# Altium schematic sheet MCU.SchDoc
size A3; ENG_APP_DATE: --/--/--; DSN_APP_DATE: --/--/--; CHK_APP_DATE: --/--/--; SheetNumber: 2; SheetTotal: 8
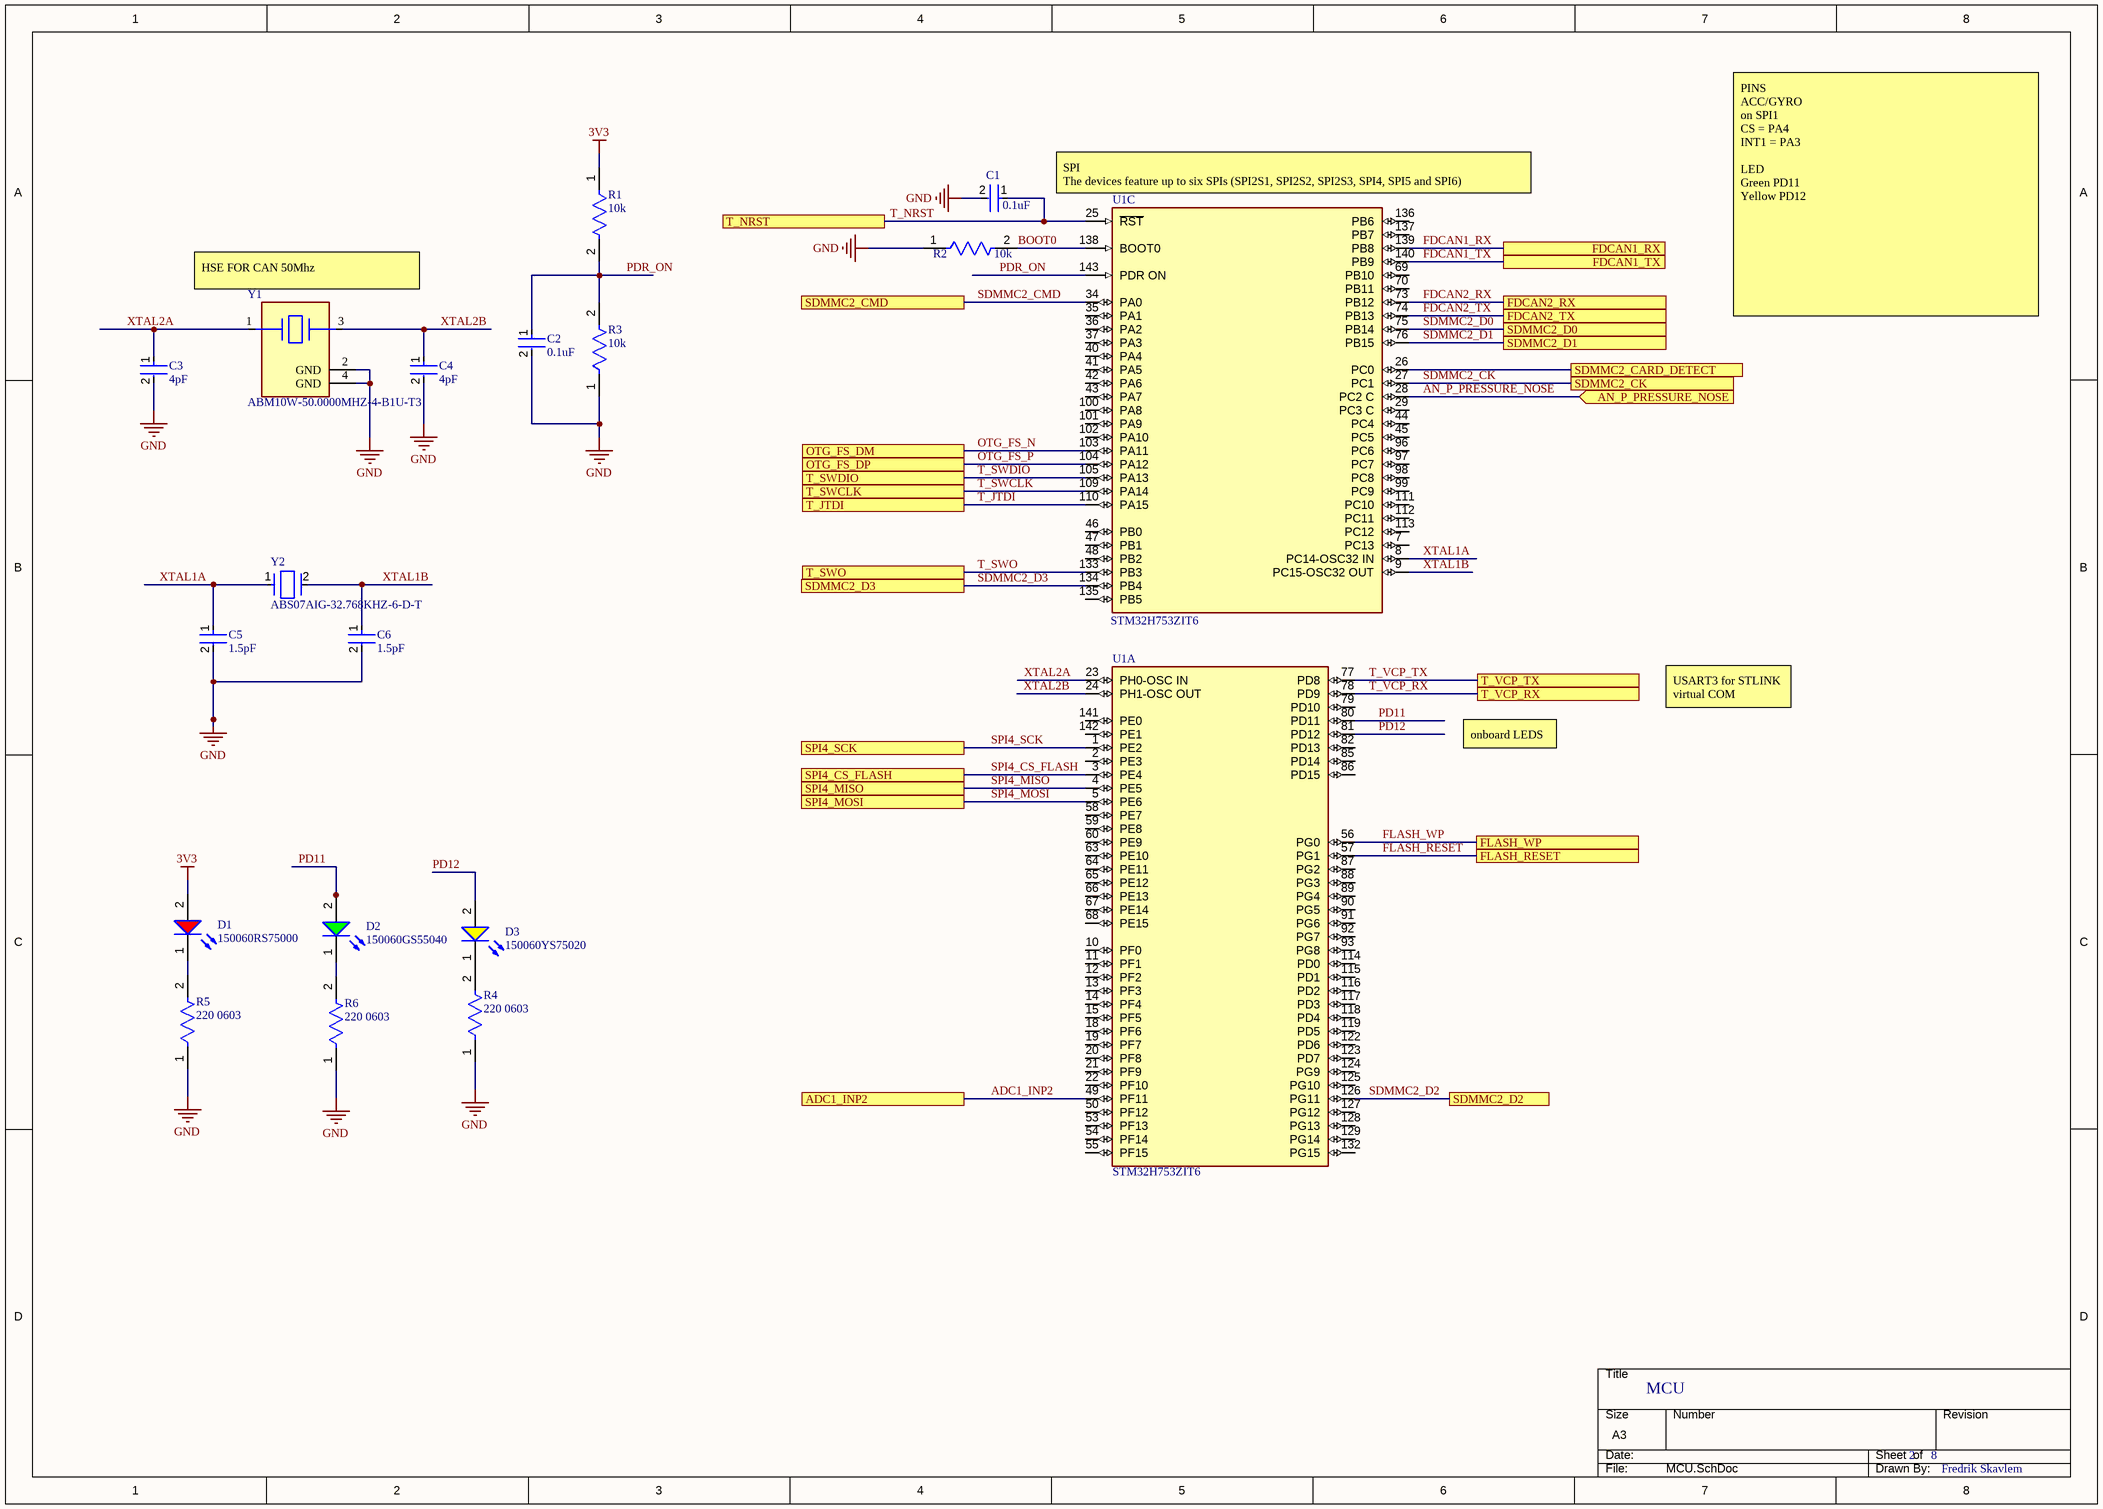
[diagram p0: MCU.SchDoc]

## Parts
C1  0.1uF  [FP-CL10-IPC_C]
C2  0.1uF  [FP-CL10-IPC_C]
C3  4pF  [FP-GQM187-0_15-IPC_B]
C4  4pF  [FP-GQM187-0_15-IPC_B]
C5  1.5pF  [FP-C0603C-CF-IPC_C]
C6  1.5pF  [FP-C0603C-CF-MFG]
D1  150060RS75000  [WL-SMCW_0603_150060xx75000]
D2  150060GS55040  [WL-SMCD_0603]
D3  150060YS75020  [WL-SMCW_0603_150060xx75020]
R1  10k  [FP-RT0603-IPC_C]
R2  10k  [FP-RT0603-IPC_C]
R3  10k  [FP-RT0603-IPC_C]
R4  220 0603  [FP-AF0603-IPC_C]
R5  220 0603  [FP-AF0603-IPC_C]
R6  220 0603  [FP-AF0603-IPC_C]
U1  STM32H753ZIT6  [FP-LQFP144-1A-MFG]  (parts A,C of 3)
Y1  ABM10W-50.0000MHZ-4-B1U-T3  [FP-ABM10W-MFG]
Y2  ABS07AIG-32.768KHZ-6-D-T  [FP-ABS07AIG-MFG]

## Ports
ADC1_INP2, AN_P_PRESSURE_NOSE (in), FDCAN1_RX, FDCAN1_TX, FDCAN2_RX, FDCAN2_TX, FLASH_RESET, FLASH_WP, OTG_FS_DM, OTG_FS_DP, SDMMC2_CARD_DETECT, SDMMC2_CK, SDMMC2_CMD, SDMMC2_D0, SDMMC2_D1, SDMMC2_D2, SDMMC2_D3, SPI4_CS_FLASH, SPI4_MISO, SPI4_MOSI, SPI4_SCK, T_JTDI, T_NRST, T_SWCLK, T_SWDIO, T_SWO, T_VCP_RX, T_VCP_TX

## Nets
3V3: D1.2(A) R1.1
GND: C1.2 C2.2 C3.2 C4.2 C5.2 C6.2 R2.1 R3.1 R4.1 R5.1 R6.1 Y1.2(GND) Y1.4(GND)
ADC1_INP2: U1.49(PF11) ; port ADC1_INP2
AN_P_PRESSURE_NOSE: U1.28(PC2_C) ; port AN_P_PRESSURE_NOSE
BOOT0: R2.2 U1.138(BOOT0)
FDCAN1_RX: U1.139(PB8) ; port FDCAN1_RX
FDCAN1_TX: U1.140(PB9) ; port FDCAN1_TX
FDCAN2_RX: U1.73(PB12) ; port FDCAN2_RX
FDCAN2_TX: U1.74(PB13) ; port FDCAN2_TX
FLASH_RESET: U1.57(PG1) ; port FLASH_RESET
FLASH_WP: U1.56(PG0) ; port FLASH_WP
OTG_FS_N: U1.103(PA11) ; port OTG_FS_DM
OTG_FS_P: U1.104(PA12) ; port OTG_FS_DP
PD11: D2.2(A) U1.80(PD11)
PD12: D3.2(A) U1.81(PD12)
PDR_ON: C2.1 R1.2 R3.2 U1.143(PDR_ON)
SDMMC2_CARD_DETECT: U1.26(PC0) ; port SDMMC2_CARD_DETECT
SDMMC2_CK: U1.27(PC1) ; port SDMMC2_CK
SDMMC2_CMD: U1.34(PA0) ; port SDMMC2_CMD
SDMMC2_D0: U1.75(PB14) ; port SDMMC2_D0
SDMMC2_D1: U1.76(PB15) ; port SDMMC2_D1
SDMMC2_D2: U1.126(PG11) ; port SDMMC2_D2
SDMMC2_D3: U1.134(PB4) ; port SDMMC2_D3
SPI4_CS_FLASH: U1.3(PE4) ; port SPI4_CS_FLASH
SPI4_MISO: U1.4(PE5) ; port SPI4_MISO
SPI4_MOSI: U1.5(PE6) ; port SPI4_MOSI
SPI4_SCK: U1.1(PE2) ; port SPI4_SCK
T_JTDI: U1.110(PA15) ; port T_JTDI
T_NRST: C1.1 U1.25(~{RST}) ; port T_NRST
T_SWCLK: U1.109(PA14) ; port T_SWCLK
T_SWDIO: U1.105(PA13) ; port T_SWDIO
T_SWO: U1.133(PB3) ; port T_SWO
T_VCP_RX: U1.78(PD9) ; port T_VCP_RX
T_VCP_TX: U1.77(PD8) ; port T_VCP_TX
XTAL1A: C5.1 U1.8(PC14-OSC32_IN) Y2.1
XTAL1B: C6.1 U1.9(PC15-OSC32_OUT) Y2.2
XTAL2A: C3.1 U1.23(PH0-OSC_IN) Y1.1
XTAL2B: C4.1 U1.24(PH1-OSC_OUT) Y1.3
NetD1_1: D1.1(K) R5.2
NetD2_1: D2.1(K) R6.2
NetD3_1: D3.1(K) R4.2

Not connected (* = marked no-connect by the designer): U1 2(PE3) 7(PC13) 10(PF0) 11(PF1) 12(PF2) 13(PF3) 14(PF4) 15(PF5) 18(PF6) 19(PF7) 20(PF8) 21(PF9) 22(PF10) 29(PC3_C) 35(PA1) 36(PA2) 37(PA3) 40(PA4) 41(PA5) 42(PA6) 43(PA7) 44(PC4) 45(PC5) 46(PB0) 47(PB1) 48(PB2) 50(PF12) 53(PF13) 54(PF14) 55(PF15) 58(PE7) 59(PE8) 60(PE9) 63(PE10) 64(PE11) 65(PE12) 66(PE13) 67(PE14) 68(PE15) 69(PB10) 70(PB11) 79(PD10) 82(PD13) 85(PD14) 86(PD15) 87(PG2) 88(PG3) 89(PG4) 90(PG5) 91(PG6) 92(PG7) 93(PG8) 96(PC6) 97(PC7) 98(PC8) 99(PC9) 100(PA8) 101(PA9) 102(PA10) 111(PC10) 112(PC11) 113(PC12) 114(PD0) 115(PD1) 116(PD2) 117(PD3) 118(PD4) 119(PD5) 122(PD6) 123(PD7) 124(PG9) 125(PG10) 127(PG12) 128(PG13) 129(PG14) 132(PG15) 135(PB5) 136(PB6) 137(PB7) 141(PE0) 142(PE1)

## Notes on the sheet
- (near U1) SPI
  The devices feature up to six SPIs (SPI2S1, SPI2S2, SPI2S3, SPI4, SPI5 and SPI6)
- (near Y1) HSE FOR CAN 50Mhz
- PINS
  ACC/GYRO
  on SPI1
  CS = PA4
  INT1 = PA3
  LED
  Green PD11
  Yellow PD12
- USART3 for STLINK virtual COM
- onboard LEDS
- MCU
- 2
- 8
- Fredrik Skavlem
- THIS DOCUMENT AND THE DATA DISCLOSED HEREIN OR
- HEREWITH IS THE PROPERTY OF ALTIUM LIMITED AND MAY
- DWG NO:
- REVISION
- REV:
- DESCRIPTION
- DATE
- APPROVED
- BE FREELY DISTRIBUTED IN WHOLE. NO RIGHTS ARE
- RESERVED OR EXPRESS OR IMPLIED WARANTEE GIVEN.
- ENG:
- APPROVALS
- PROJECT
- DSN:
- CHK:
- REFERENCE DOCUMENTS
- PROJECT REVISION:
- TITLE
- DOCUMENT REVISION:
- DESIGN ITEM:
- BOM:
- FAB DWG:
- PCB DWG:
- ASSY DWG:
- SCALE:
- A3
- SIZE
- CAGE CODE
- FILE NAME
- DWG NO.
- SHEET
- OF
- REV

## Library data of the parts
C1 C2 = CMP-13271-002683-1: Cap Ceramic 100nF 16V X7R ±10% Pad SMD 0603 +125°C T/R / CL10B104KO8WPNC; Voltage Rating: 16V; Max Operating Temperature: 125°C; Capacitance: 100nF; Features: Soft Termination; Length: 0.063inch; Packaging: Tape and Reel; Min Operating Temperature: -55°C; Mount: Surface Mount; Case/Package: 0603; Case Code (Metric): 1608; Width: 0.031inch; Ratings: AEC-Q200; Thickness: 0.035inch; Case Code (Imperial): 0603; Tolerance: 10%
C3 C4 = CMP-06035-061124-1: GQM1875C2E4R0BB12D / Ceramic Capacitor 4pF ±0.1pF 250VDC C0G 0603 Paper T/R; Voltage Rating: 250V; Thickness: 0.031inch; Packaging: Tape and Reel; Case Code (Metric): 1608; Series: GQM; Length: 1.6mm; Height: 0.7mm; Width: 0.8mm; Max Operating Temperature: 125°C; Case Code (Imperial): 0603; Capacitance: 4pF; Min Operating Temperature: -55°C; Construction: Flat; Package Quantity: 4000; Case/Package: 0603; Voltage Rating (DC): 250V; Mount: Surface Mount; Dielectric: C0G; Depth: 0.8mm; Termination: SMD/SMT; Radiation Hardening: No
C5 C6 = CMP-03020-023157-1: C0603 1.5 pF X8R 30ppm/°C 0.1 pF 25 V / C0603C159B3HACTU; Manufacturer: KEMET; Automotive Grade: Grade 1; Material: Ceramic; Tolerance: 0.1 pF; Voltage Rating: 25 V; Capacitance: 1.5 pF; Device Class L3: Ceramic Capacitors; Temperature Range High: +125°C; Category: Cap; Octopart: https://octopart.com/c0603c159b3hactu-kemet-88725126; Package: C0603C-CF; Temperature: -55°C to +125°C; RoHS: TRUE; Automotive: Yes; ComponentLink2URL: https://api.kemet.com/component-edge/download/datasheet/C0603C100J5GACAUTO.pdf; Value: 1.5 pF; Device Class L2: Capacitors; ComponentLink2Description: Datasheet; Temperature Characteristic: X8R; Lead Free: Yes; Temperature Range Low: -55°C; Temperature Coefficient: 30ppm/°C; Height: 0.87mm; Device Class L1: Passive Components; Manufacturer Part Number: C0603C159B3HACTU
D1 = CMP-1426-00001-3: NexarPartId: 29717776; Color: Red; Power Dissipation: 72mW; Max Reverse Voltage (DC): 5V; Peak Wavelength: 630nm; Viewing Angle: 140°; Forward Voltage: 2V; Luminous Intensity: 250mcd; Forward Current: 100mA; Dominant Wavelength: 625nm; Lens Style: Clear, Rectangular; Max Junction Temperature (Tj): 95°C; Test Current: 20mA; Mount: Surface Mount; Packaging: Tape and Reel; Case Code (Metric): 1608; Max Operating Temperature: 85°C; Case Code (Imperial): 0603; REACH SVHC: Unknown; Width: 800µm; Length: 1.6mm; Reverse Voltage: 5V; Height: 700µm; Case/Package: 0603; RoHS: Compliant; Wavelength: 625nm; Min Operating Temperature: -40°C
D2 = CMP-03913-90235563-2: 150060GS55040 WL-SMCD SMT Mono-color Chip LED Diffused; Forward Voltage: 3.2V; Forward Current: 60mA; Luminous Intensity: 430mcd; Peak Wavelength: 520nm; Viewing Angle: 140°; Wavelength: 525nm; Max Reverse Voltage (DC): 5V; Max Operating Temperature: 85°C; Length: 1.6mm; Height: 400µm; Packaging: Tape and Reel; NexarPartId: 90235563; Dominant Wavelength: 525nm; Min Operating Temperature: -40°C; RoHS: Compliant; Width: 800µm
D3 = CMP-03913-104891429-2: WL-SMCW SMT Mono-Color Chip LED Waterclear super f; Forward Voltage: 2V; Forward Current: 60mA; Max Reverse Voltage (DC): 5V; Peak Wavelength: 595nm; Viewing Angle: 140°; Dominant Wavelength: 590nm; Luminous Intensity: 130mcd; Width: 800µm; RoHS: Compliant; Min Operating Temperature: -40°C; Max Operating Temperature: 85°C; Length: 1.6mm; Height: 250µm
R1-R3 = CMP-03412-005349-1: RES SMD 10K OHM 1% 1/10W 0603 / RT0603FRE0710KL; Manufacturer: Yageo; Value: 10KΩ; Temperature Coefficient: 50 ppm/°C; Power Rating: 0.1W; Tolerance: 0.01; Voltage Rating: 75V; RoHS: TRUE; Category: Res; Automotive: No; Digikey Description: RES SMD 10K OHM 1% 1/10W 0603; ComponentLink2Description: Datasheet; Octopart: https://octopart.com/rt0603fre0710kl-yageo-40009243; ComponentLink2URL: http://www.yageo.com/documents/recent/PYu-RT_1-to-0.01_RoHS_L_9.pdf; Device Class L3: Chip SMD Resistors; Device Class L1: Passive Components; Temperature Range High: +155°C; Height: 0.55mm; Composition: Thin Film; Ipc Land Pattern Name: RESC16080X45; Series: RT; Package: RT0603; Resistance: 10KΩ; Footprint Url: http://www.yageo.com/exep/pages/download/literatures/PYu-R_Mount_10.pdf; Temperature: -55°C to +155°C; Temperature Range Low: -55°C; Lead Free: Yes; Device Class L2: Resistors; Mouser Description: Thin Film Resistors - SMD 10K ohm 1% 1/10W; Manufacturer Part Number: RT0603FRE0710KL
R4-R6 = CMP-03412-038529-1: AF0603JR-07220RL Anti-Sulfurated Chip Resistors Automotive Grade 220Ω 5% 100ppm/°C 0603; Max Power Dissipation: 100mW; Resistance: 220R; Width: 0.031inch; Case/Package: 0603; Series: AF; Features: Moisture Resistant; Tolerance: 5%; Resistor Type: Thick Film; Max Operating Temperature: 155°C; Length: 0.063inch; RoHS Compliant: Yes; Lead Free: Lead Free; Packaging: Tape and Reel; Number of Terminations: 2; Temperature Coefficient: 100ppm/°C; Height: 0.022inch; Min Operating Temperature: -55°C
U1 = CMP-12105-000009-1: LQFP 144 20X20X1.4 2; Manufacturer: STMicroelectronics; Number Of Pwm Channels: 24; Number Of I/Os: 114; Number Of Cores: 1; Min Supply Voltage: 1.62V; Interface: I2C,SPI,UART,USART,CAN,USB,LIN,IrDA,Ethernet,I2S,SMBus,Other; Standoff Height: 0.05mm; Number Of I2C Channels: 4; Max Junction Temp: +125°C; Memory Type: FLASH; Ram Size: 1MBytes; Number Of Spi Channels: 6; Core Architecture: ARM Cortex-M7; Number Of Uart Channels: 9; Memory Size: 2MBytes; Number Of Adc Channels: 36; Frequency: 480MHz; Data Bus Width: 32bits; Max Supply Voltage: 3.6V; Number Of Usb Channels: 2; Number Of A/D Converters: 3; Number Of Timers/Counters: 20; Temperature Range High: +125°C; Automotive: No; Mouser Description: MCU 32-Bit STM32 ARM Cortex M7 RISC 2MB Flash 1.8V/2.5V/3.3V 144-Pin LQFP Tray; Device Class L3: Microcontrollers; Height: 1.6mm; Octopart: https://octopart.com/stm32h753zit6-stmicroelectronics-87879771; Device Class L2: Embedded Processors and Controllers; Lead Free: Yes; Category: IC; ComponentLink2URL: https://www.st.com/resource/en/datasheet/stm32h753zi.pdf; Ambient Temperature Range High: +85°C; Number Of Ethernet Channels: 1; Device Class L1: Integrated Circuits (ICs); Ambient Temperature Range Low: -40°C; Package: LQFP144-1A; Temperature Range Low: -40°C; Digikey Description: LQFP 144 20X20X1.4 2; ComponentLink2Description: Datasheet; Temperature: -40°C to +125°C; Manufacturer Part Number: STM32H753ZIT6; RoHS: TRUE
Y1 = CMP-27762-007472-1: Crystal 50MHz ±10ppm 4pF SMD-4 2.5mm x 2mm; ESR (Equivalent Series Resistance): 70R; Frequency Tolerance: 10ppm; Mount: Surface Mount; Min Operating Temperature: -20°C; RoHS Compliant: Yes; Load Capacitance: 4pF; Frequency: 50MHz; Case/Package: SMD/SMT; Frequency Stability: 10ppm; Packaging: Tape and Reel; Max Operating Temperature: 70°C
Y2 = CMP-27762-015953-1: Crystal 32.768kHz ±20ppm (Tol) 6pF FUND 70kΩ Automotive 2-Pin Mini-CSMD T/R; ESR (Equivalent Series Resistance): 70kR; Case/Package: SMD/SMT; Packaging: Cut Tape; Width: 0.059inch; Load Capacitance: 6pF; Height: 0.035inch; Max Operating Temperature: 85°C; Length: 0.126inch; RoHS Compliant: Yes; Mount: Surface Mount; Min Operating Temperature: -40°C; Ratings: AEC-Q200; Series: ABS07AIG; Frequency Tolerance: 20ppm; Frequency: 32.768kHz